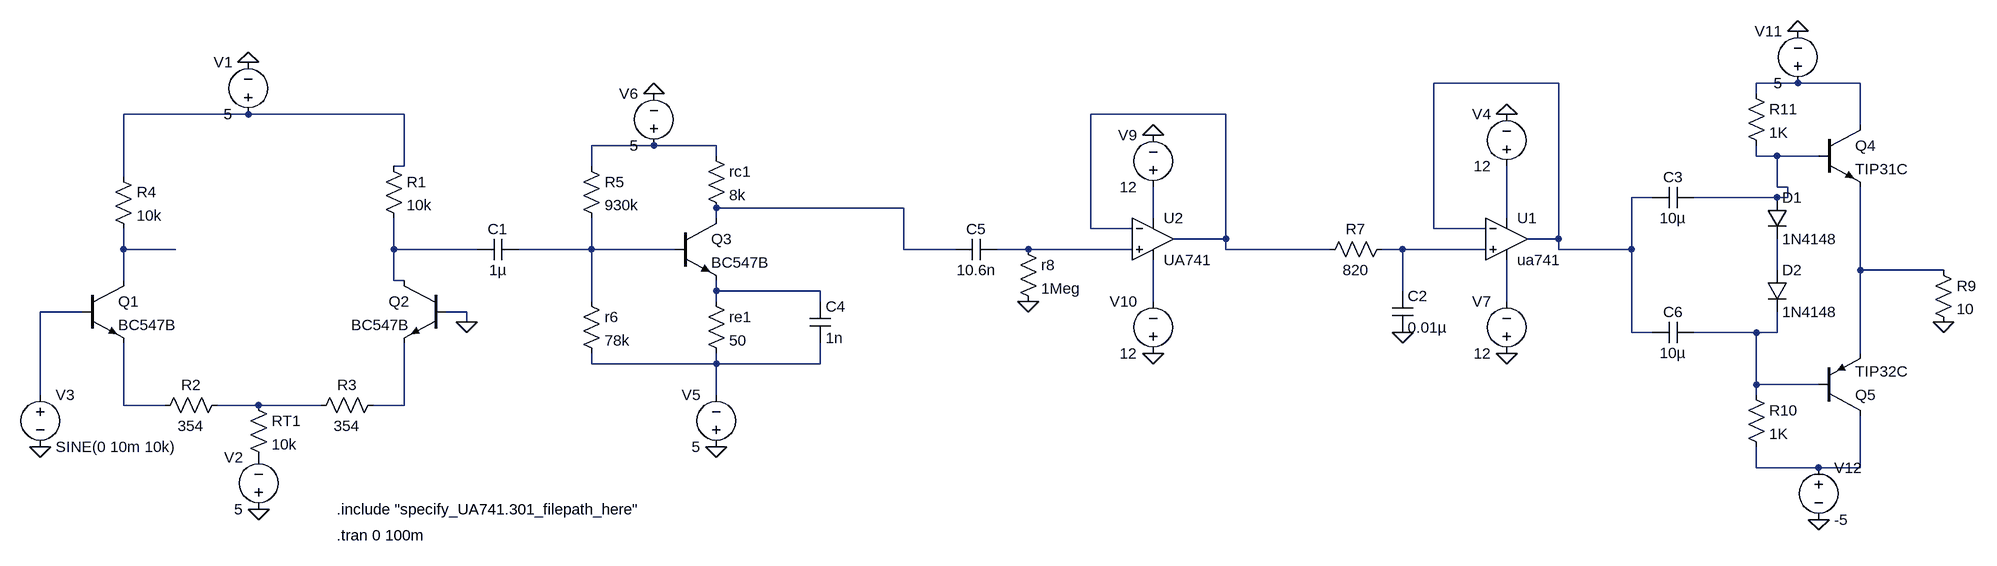
[diagram p0: schematic final_circuit.asc]
final_circuit.asc, the LTspice schematic file:
Version 4
SHEET 1 4696 980
WIRE 2176 -288 1984 -288
WIRE 2544 -288 2480 -288
WIRE 2640 -288 2544 -288
WIRE 2480 -272 2480 -288
WIRE 160 -240 -32 -240
WIRE 400 -240 160 -240
WIRE 1664 -240 1456 -240
WIRE 2640 -224 2640 -288
WIRE 784 -192 688 -192
WIRE 880 -192 784 -192
WIRE 880 -176 880 -192
WIRE 2480 -176 2480 -192
WIRE 2512 -176 2480 -176
WIRE 2576 -176 2512 -176
WIRE 400 -160 400 -240
WIRE 400 -160 384 -160
WIRE 688 -160 688 -192
WIRE -32 -144 -32 -240
WIRE 2512 -128 2512 -176
WIRE 2528 -128 2512 -128
WIRE 2320 -112 2288 -112
WIRE 2512 -112 2384 -112
WIRE 2528 -112 2528 -128
WIRE 2528 -112 2512 -112
WIRE 1168 -96 880 -96
WIRE 880 -80 880 -96
WIRE 1552 -80 1552 -128
WIRE 2096 -80 2096 -160
WIRE 1456 -64 1456 -240
WIRE 1520 -64 1456 -64
WIRE 1984 -64 1984 -288
WIRE 2064 -64 1984 -64
WIRE 1664 -48 1664 -240
WIRE 1664 -48 1584 -48
WIRE 2176 -48 2176 -288
WIRE 2176 -48 2128 -48
WIRE -32 -32 -32 -64
WIRE 48 -32 -32 -32
WIRE 384 -32 384 -80
WIRE 512 -32 384 -32
WIRE 688 -32 688 -80
WIRE 688 -32 576 -32
WIRE 816 -32 688 -32
WIRE 1168 -32 1168 -96
WIRE 1248 -32 1168 -32
WIRE 1360 -32 1312 -32
WIRE 1520 -32 1360 -32
WIRE 1664 -32 1664 -48
WIRE 1824 -32 1664 -32
WIRE 1936 -32 1904 -32
WIRE 2064 -32 1936 -32
WIRE 2176 -32 2176 -48
WIRE 2288 -32 2288 -112
WIRE 2288 -32 2176 -32
WIRE 2512 0 2512 -48
WIRE 2640 0 2640 -128
WIRE 2768 0 2640 0
WIRE -32 16 -32 -32
WIRE 384 16 384 -32
WIRE 400 16 384 16
WIRE 880 32 880 16
WIRE 1040 32 880 32
WIRE 1936 32 1936 -32
WIRE 688 48 688 -32
WIRE 880 48 880 32
WIRE 1040 48 1040 32
WIRE 1552 48 1552 -16
WIRE 2096 48 2096 -16
WIRE -96 64 -160 64
WIRE 496 64 464 64
WIRE 496 80 496 64
WIRE 2288 96 2288 -32
WIRE 2320 96 2288 96
WIRE 2480 96 2384 96
WIRE 2512 96 2512 64
WIRE 2512 96 2480 96
WIRE 2640 128 2640 0
WIRE 688 144 688 128
WIRE 880 144 880 128
WIRE 880 144 688 144
WIRE 1040 144 1040 112
WIRE 1040 144 880 144
WIRE 2480 176 2480 96
WIRE 2576 176 2480 176
WIRE -160 192 -160 64
WIRE 880 192 880 144
WIRE 2480 192 2480 176
WIRE -32 208 -32 112
WIRE 32 208 -32 208
WIRE 176 208 112 208
WIRE 272 208 176 208
WIRE 400 208 400 112
WIRE 400 208 352 208
WIRE 2480 304 2480 272
WIRE 2576 304 2480 304
WIRE 2640 304 2640 224
WIRE 2640 304 2576 304
FLAG -160 272 0
FLAG 1936 96 0
FLAG 2096 -240 0
FLAG 2096 128 0
FLAG 1552 -208 0
FLAG 1360 48 0
FLAG 496 80 0
FLAG 2544 -368 0
FLAG 2576 384 0
FLAG 2768 80 0
FLAG 784 -272 0
FLAG 160 -320 0
FLAG 176 368 0
FLAG 880 272 0
FLAG 1552 128 0
SYMBOL npn -96 16 R0
SYMATTR InstName Q1
SYMATTR Value BC547B
SYMBOL npn 464 16 M0
SYMATTR InstName Q2
SYMATTR Value BC547B
SYMBOL voltage 160 -224 R180
WINDOW 0 24 96 Left 2
WINDOW 3 24 16 Left 2
WINDOW 123 0 0 Left 0
WINDOW 39 0 0 Left 0
SYMATTR InstName V1
SYMATTR Value 5
SYMBOL voltage 176 384 R180
WINDOW 0 24 96 Left 2
WINDOW 3 24 16 Left 2
WINDOW 123 0 0 Left 0
WINDOW 39 0 0 Left 0
SYMATTR InstName V2
SYMATTR Value 5
SYMBOL res 368 -176 R0
SYMATTR InstName R1
SYMATTR Value 10k
SYMBOL res 160 192 R0
SYMATTR InstName RT1
SYMATTR Value 10k
SYMBOL voltage -160 176 R0
WINDOW 123 0 0 Left 0
WINDOW 39 0 0 Left 0
SYMATTR InstName V3
SYMATTR Value SINE(0 10m 10k)
SYMBOL res 128 192 R90
WINDOW 0 0 56 VBottom 2
WINDOW 3 32 56 VTop 2
SYMATTR InstName R2
SYMATTR Value 354
SYMBOL res 368 192 R90
WINDOW 0 0 56 VBottom 2
WINDOW 3 32 56 VTop 2
SYMATTR InstName R3
SYMATTR Value 354
SYMBOL res -48 -160 R0
SYMATTR InstName R4
SYMATTR Value 10k
SYMBOL npn 816 -80 R0
SYMATTR InstName Q3
SYMATTR Value BC547B
SYMBOL res 864 -192 R0
SYMATTR InstName rc1
SYMATTR Value 8k
SYMBOL res 672 -176 R0
SYMATTR InstName R5
SYMATTR Value 930k
SYMBOL res 672 32 R0
SYMATTR InstName r6
SYMATTR Value 78k
SYMBOL res 864 32 R0
SYMATTR InstName re1
SYMATTR Value 50
SYMBOL cap 1024 48 R0
SYMATTR InstName C4
SYMATTR Value 1n
SYMBOL res 1920 -48 R90
WINDOW 0 0 56 VBottom 2
WINDOW 3 32 56 VTop 2
SYMATTR InstName R7
SYMATTR Value 820
SYMBOL cap 1920 32 R0
SYMATTR InstName C2
SYMATTR Value 0.01µ
SYMBOL OpAmps\\opamp2 2096 -112 R0
SYMATTR InstName U1
SYMATTR Value ua741
SYMBOL voltage 2096 -144 R180
WINDOW 0 24 96 Left 2
WINDOW 3 24 16 Left 2
WINDOW 123 0 0 Left 0
WINDOW 39 0 0 Left 0
SYMATTR InstName V4
SYMATTR Value 12
SYMBOL voltage 2096 144 R180
WINDOW 0 24 96 Left 2
WINDOW 3 24 16 Left 2
WINDOW 123 0 0 Left 0
WINDOW 39 0 0 Left 0
SYMATTR InstName V7
SYMATTR Value 12
SYMBOL cap 1312 -48 R90
WINDOW 0 0 32 VBottom 2
WINDOW 3 32 32 VTop 2
SYMATTR InstName C5
SYMATTR Value 10.6n
SYMBOL OpAmps\\opamp2 1552 -112 R0
SYMATTR InstName U2
SYMATTR Value UA741
SYMBOL voltage 1552 -112 R180
WINDOW 0 24 96 Left 2
WINDOW 3 24 16 Left 2
WINDOW 123 0 0 Left 0
WINDOW 39 0 0 Left 0
SYMATTR InstName V9
SYMATTR Value 12
SYMBOL voltage 1552 144 R180
WINDOW 0 24 96 Left 2
WINDOW 3 24 16 Left 2
WINDOW 123 0 0 Left 0
WINDOW 39 0 0 Left 0
SYMATTR InstName V10
SYMATTR Value 12
SYMBOL res 1344 -48 R0
SYMATTR InstName r8
SYMATTR Value 1Meg
SYMBOL npn 2576 -224 R0
SYMATTR InstName Q4
SYMATTR Value TIP31C
SYMBOL pnp 2576 224 M180
SYMATTR InstName Q5
SYMATTR Value TIP32C
SYMBOL voltage 2544 -272 R180
WINDOW 0 24 96 Left 2
WINDOW 3 24 16 Left 2
WINDOW 123 0 0 Left 0
WINDOW 39 0 0 Left 0
SYMATTR InstName V11
SYMATTR Value 5
SYMBOL voltage 2576 288 R0
WINDOW 123 0 0 Left 0
WINDOW 39 0 0 Left 0
SYMATTR InstName V12
SYMATTR Value -5
SYMBOL res 2752 -16 R0
SYMATTR InstName R9
SYMATTR Value 10
SYMBOL res 2464 176 R0
SYMATTR InstName R10
SYMATTR Value 1K
SYMBOL res 2464 -288 R0
SYMATTR InstName R11
SYMATTR Value 1K
SYMBOL cap 2384 80 R90
WINDOW 0 0 32 VBottom 2
WINDOW 3 32 32 VTop 2
SYMATTR InstName C6
SYMATTR Value 10µ
SYMBOL diode 2496 -112 R0
SYMATTR InstName D1
SYMATTR Value 1N4148
SYMBOL diode 2496 0 R0
SYMATTR InstName D2
SYMATTR Value 1N4148
SYMBOL cap 2384 -128 R90
WINDOW 0 0 32 VBottom 2
WINDOW 3 32 32 VTop 2
SYMATTR InstName C3
SYMATTR Value 10µ
SYMBOL cap 576 -48 R90
WINDOW 0 0 32 VBottom 2
WINDOW 3 32 32 VTop 2
SYMATTR InstName C1
SYMATTR Value 1µ
SYMBOL voltage 880 288 R180
WINDOW 0 24 96 Left 2
WINDOW 3 24 16 Left 2
WINDOW 123 0 0 Left 0
WINDOW 39 0 0 Left 0
SYMATTR InstName V5
SYMATTR Value 5
SYMBOL voltage 784 -176 R180
WINDOW 0 24 96 Left 2
WINDOW 3 24 16 Left 2
WINDOW 123 0 0 Left 0
WINDOW 39 0 0 Left 0
SYMATTR InstName V6
SYMATTR Value 5
TEXT 296 408 Left 2 !.tran 0 100m
TEXT 296 368 Left 2 !.include "specify_UA741.301_filepath_here"

The netlist it stands for:
* final_circuit.asc
Q1 N010 N020 N023 0 BC547B
Q2 N011 0 N025 0 BC547B
V1 N003 0 5
V2 0 P001 5
R1 N003 N011 10k
RT1 N024 P001 10k
V3 N020 0 SINE(0 10m 10k)
R2 N024 N023 354
R3 N025 N024 354
R4 N003 N010 10k
Q3 N007 N012 N017 0 BC547B
rc1 N005 N007 8k
R5 N005 N012 930k
r6 N012 N022 78k
re1 N017 N022 50
C4 N017 N022 1n
R7 N014 N004 820
C2 N014 0 0.01µ
XU1 N014 N001 N009 N019 N001 ua741  ; pins In+ In- V+ V- OUT
V4 N009 0 12
V7 0 N019 12
C5 N013 N007 10.6n
XU2 N013 N004 N008 N018 N004 UA741  ; pins In+ In- V+ V- OUT
V9 N008 0 12
V10 0 N018 12
r8 N013 0 1Meg
Q4 N002 N006 N016 0 TIP31C
Q5 N026 N021 N016 0 TIP32C
V11 N002 0 5
V12 N026 0 -5
R9 N016 0 10
R10 N021 N026 1K
R11 N002 N006 1K
C6 N021 N001 10µ
D1 N006 N015 1N4148
D2 N015 N021 1N4148
C3 N006 N001 10µ
C1 N012 N011 1µ
V5 0 N022 5
V6 N005 0 5
.model D D
.lib standard.dio
.model NPN NPN
.model PNP PNP
.lib standard.bjt
.tran 0 100m
.include "specify_UA741.301_filepath_here"
.backanno
.end